# Altium project Dingo_PCB.PrjPcb
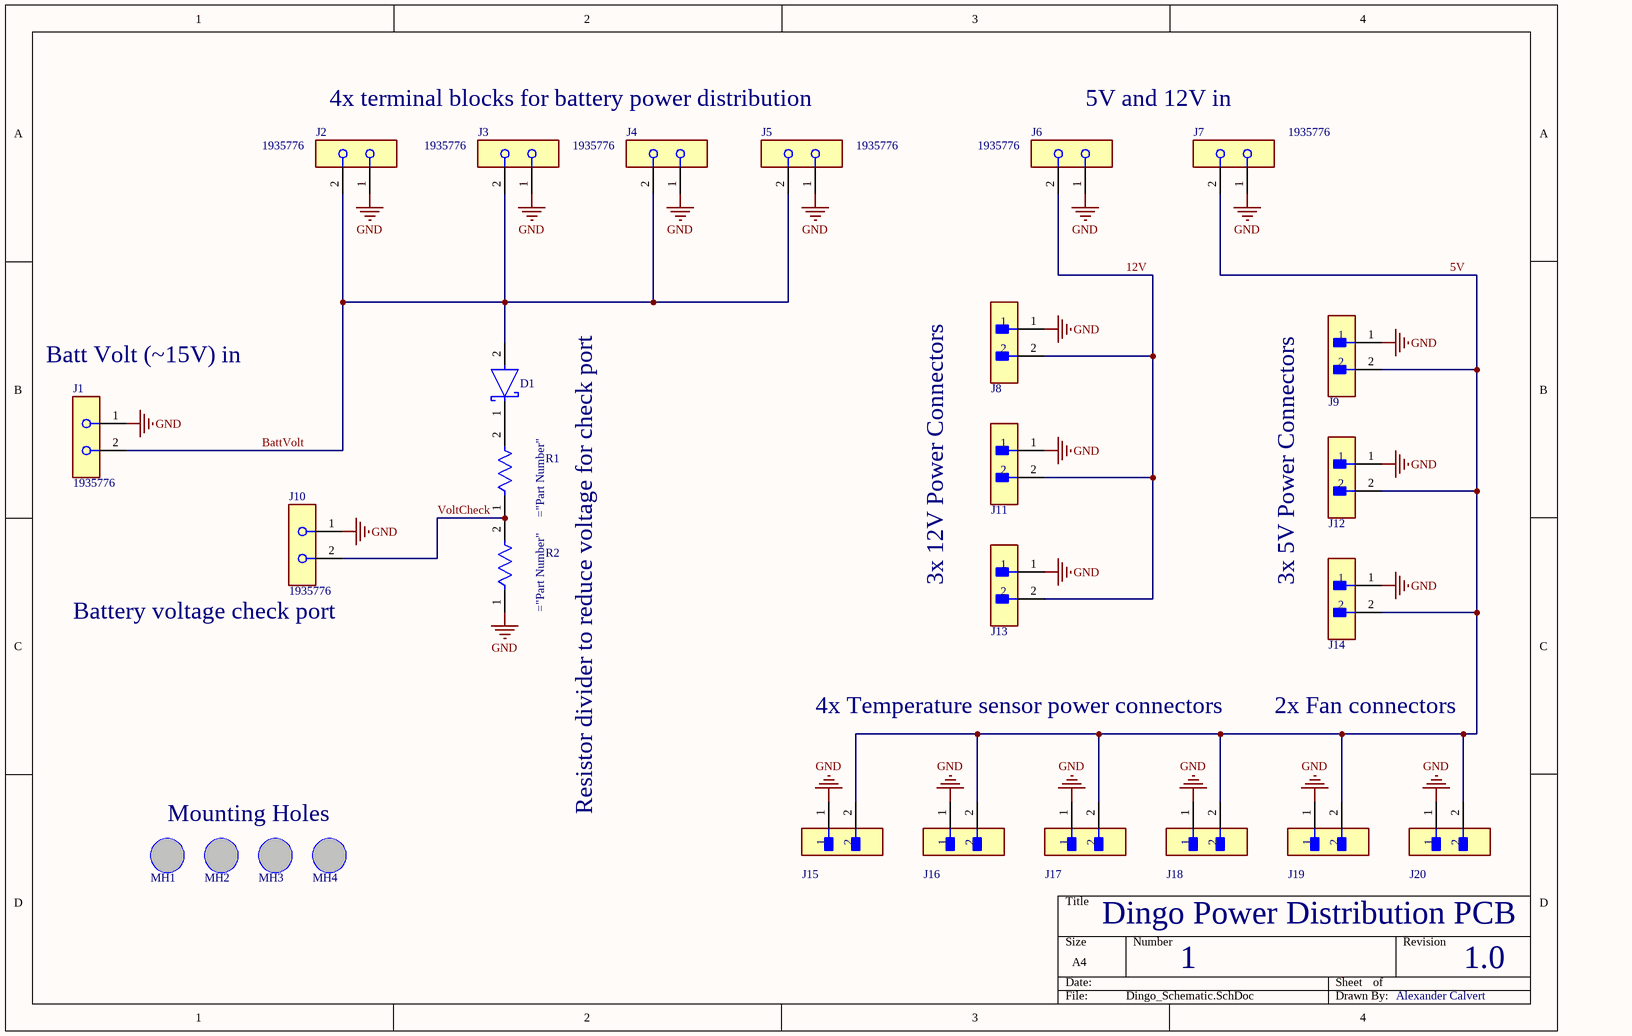
[diagram p0: Dingo_Schematic.SchDoc]
1 sheet, 27 parts. Net scope: global (net labels, ports and power ports of the same name join across sheets).
Board file: Dingo_PCB.PcbDoc

## Sheet Dingo_Schematic.SchDoc
size A4; SheetNumber: 1; SheetTotal: 1

### Parts
D1  Diode  [Diodes_Inc_SMA_MFG]  (value not drawn)
J1  Part Number: 1935776  [Phoenix_Contact_1935776_0]  (hidden comment: battery Input)
J2  Part Number: 1935776  [Phoenix_Contact_1935776_0]  (hidden comment: Spare connector)
J3  Part Number: 1935776  [Phoenix_Contact_1935776_0]  (hidden comment: To 7.8V rail)
J4  Part Number: 1935776  [Phoenix_Contact_1935776_0]  (hidden comment: To 5V rail)
J5  Part Number: 1935776  [Phoenix_Contact_1935776_0]  (hidden comment: To 12V rail)
J6  Part Number: 1935776  [Phoenix_Contact_1935776_0]  (hidden comment: 12V rail return)
J7  Part Number: 1935776  [Phoenix_Contact_1935776_0]  (hidden comment: 5V rail return)
J8  12Vout1  [JST_0_MFG]  (value not drawn)
J9  5Vout1  [JST_0_MFG]  (value not drawn)
J10  Part Number: 1935776  [Phoenix_Contact_1935776_0]  (hidden comment: TeensyADCport)
J11  12Vout2  [JST_0_MFG]  (value not drawn)
J12  5Vout2  [JST_0_MFG]  (value not drawn)
J13  12Vout3  [JST_0_MFG]  (value not drawn)
J14  5Vout3  [JST_0_MFG]  (value not drawn)
J15  Temp1  [JST_0_MFG]  (value not drawn)
J16  Temp2  [JST_0_MFG]  (value not drawn)
J17  Temp3  [JST_0_MFG]  (value not drawn)
J18  Temp4  [JST_0_MFG]  (value not drawn)
J19  Fan1  [JST_0_MFG]  (value not drawn)
J20  Fan2  [JST_0_MFG]  (value not drawn)
MH1  Mounting Hole Non-Plated 3.2mm  [MH3.2mm]  (value not drawn)
MH2  Mounting Hole Non-Plated 3.2mm  [MH3.2mm]  (value not drawn)
MH3  Mounting Hole Non-Plated 3.2mm  [MH3.2mm]  (value not drawn)
MH4  Mounting Hole Non-Plated 3.2mm  [MH3.2mm]  (value not drawn)
R1  47k  [TE_Connectivity_CRGCQ1206_IPC_A]  (value not drawn)
R2  10k  [TE_Connectivity_CRGCQ0805_IPC_A]  (value not drawn)

### Nets
GND: J1.1 J2.1 J3.1 J4.1 J5.1 J6.1 J7.1 J8.1 J9.1 J10.1 J11.1 J12.1 J13.1 J14.1 J15.1 J16.1 J17.1 J18.1 J19.1 J20.1 R2.1
5V: J7.2 J9.2 J12.2 J14.2 J15.2 J16.2 J17.2 J18.2 J19.2 J20.2
12V: J6.2 J8.2 J11.2 J13.2
BattVolt: D1.2(A) J1.2 J2.2 J3.2 J4.2 J5.2
VoltCheck: J10.2 R1.1 R2.2
NetD1_1: D1.1(C) R1.2

### Notes on the sheet
- 4x terminal blocks for battery power distribution
- 5V and 12V in
- Batt Volt (~15V) in
- 3x 12V Power Connectors
- 3x 5V Power Connectors
- (near J10) Battery voltage check port
- 4x Temperature sensor power connectors
- 2x Fan connectors
- Mounting Holes
- Resistor divider to reduce voltage for check port
- Dingo Power Distribution PCB
- 1
- 1.0
- Alexander Calvert

### Library data of the parts
D1 = B160-13-F
J1-J7 J10 = Conn_Phoenix_Contact_1935776_eec: CONN 2 Position Wire to Board Terminal Block Horizontal with Board 0.197" (5.00mm) Through Hole; Manufacturer: Phoenix Contact; Voltage: 300V; Is Female: yes; helpURL: https://upverter.com/upn/revision/23a85baadd8e96ab/; ComponentLink2Description: Datasheet; Temperature: to; Package: CONN_PTH_TERMINAL BLOCK; Supplier 2: Mouser; Price: 0.394437234895; Supplier 1: Digi-Key; ComponentLink1URL: https://upverter.com/upn/revision/23a85baadd8e96ab/; Supplier Part Number 2: 651-1935776; Supplier Part Number 1: 277-6405-ND; ComponentLink1Description: Upverter; ComponentLink2URL: http://select.phoenixcontact.com/phoenix/dwld/00846397_00_fam.pdf?cp=y&asid2=080208969559730; RoHS: TRUE; Mouser Part Number: 651-1935776; Digikey Description: CONN 2 Position Wire to Board Terminal Block Horizontal with Board 0.197" (5.00mm) Through Hole; Digikey Part Number: 277-6405-ND; Lead Free: yes
J8 J9 J11-J20 = B2B-PH-K-S_LF_SN
MH1-MH4 = MH3P2MM: Mounting Hole Non-Plated 3.2mm drill hole
R1 = CRGCQ1206F47K
R2 = CRGCQ0805F10K